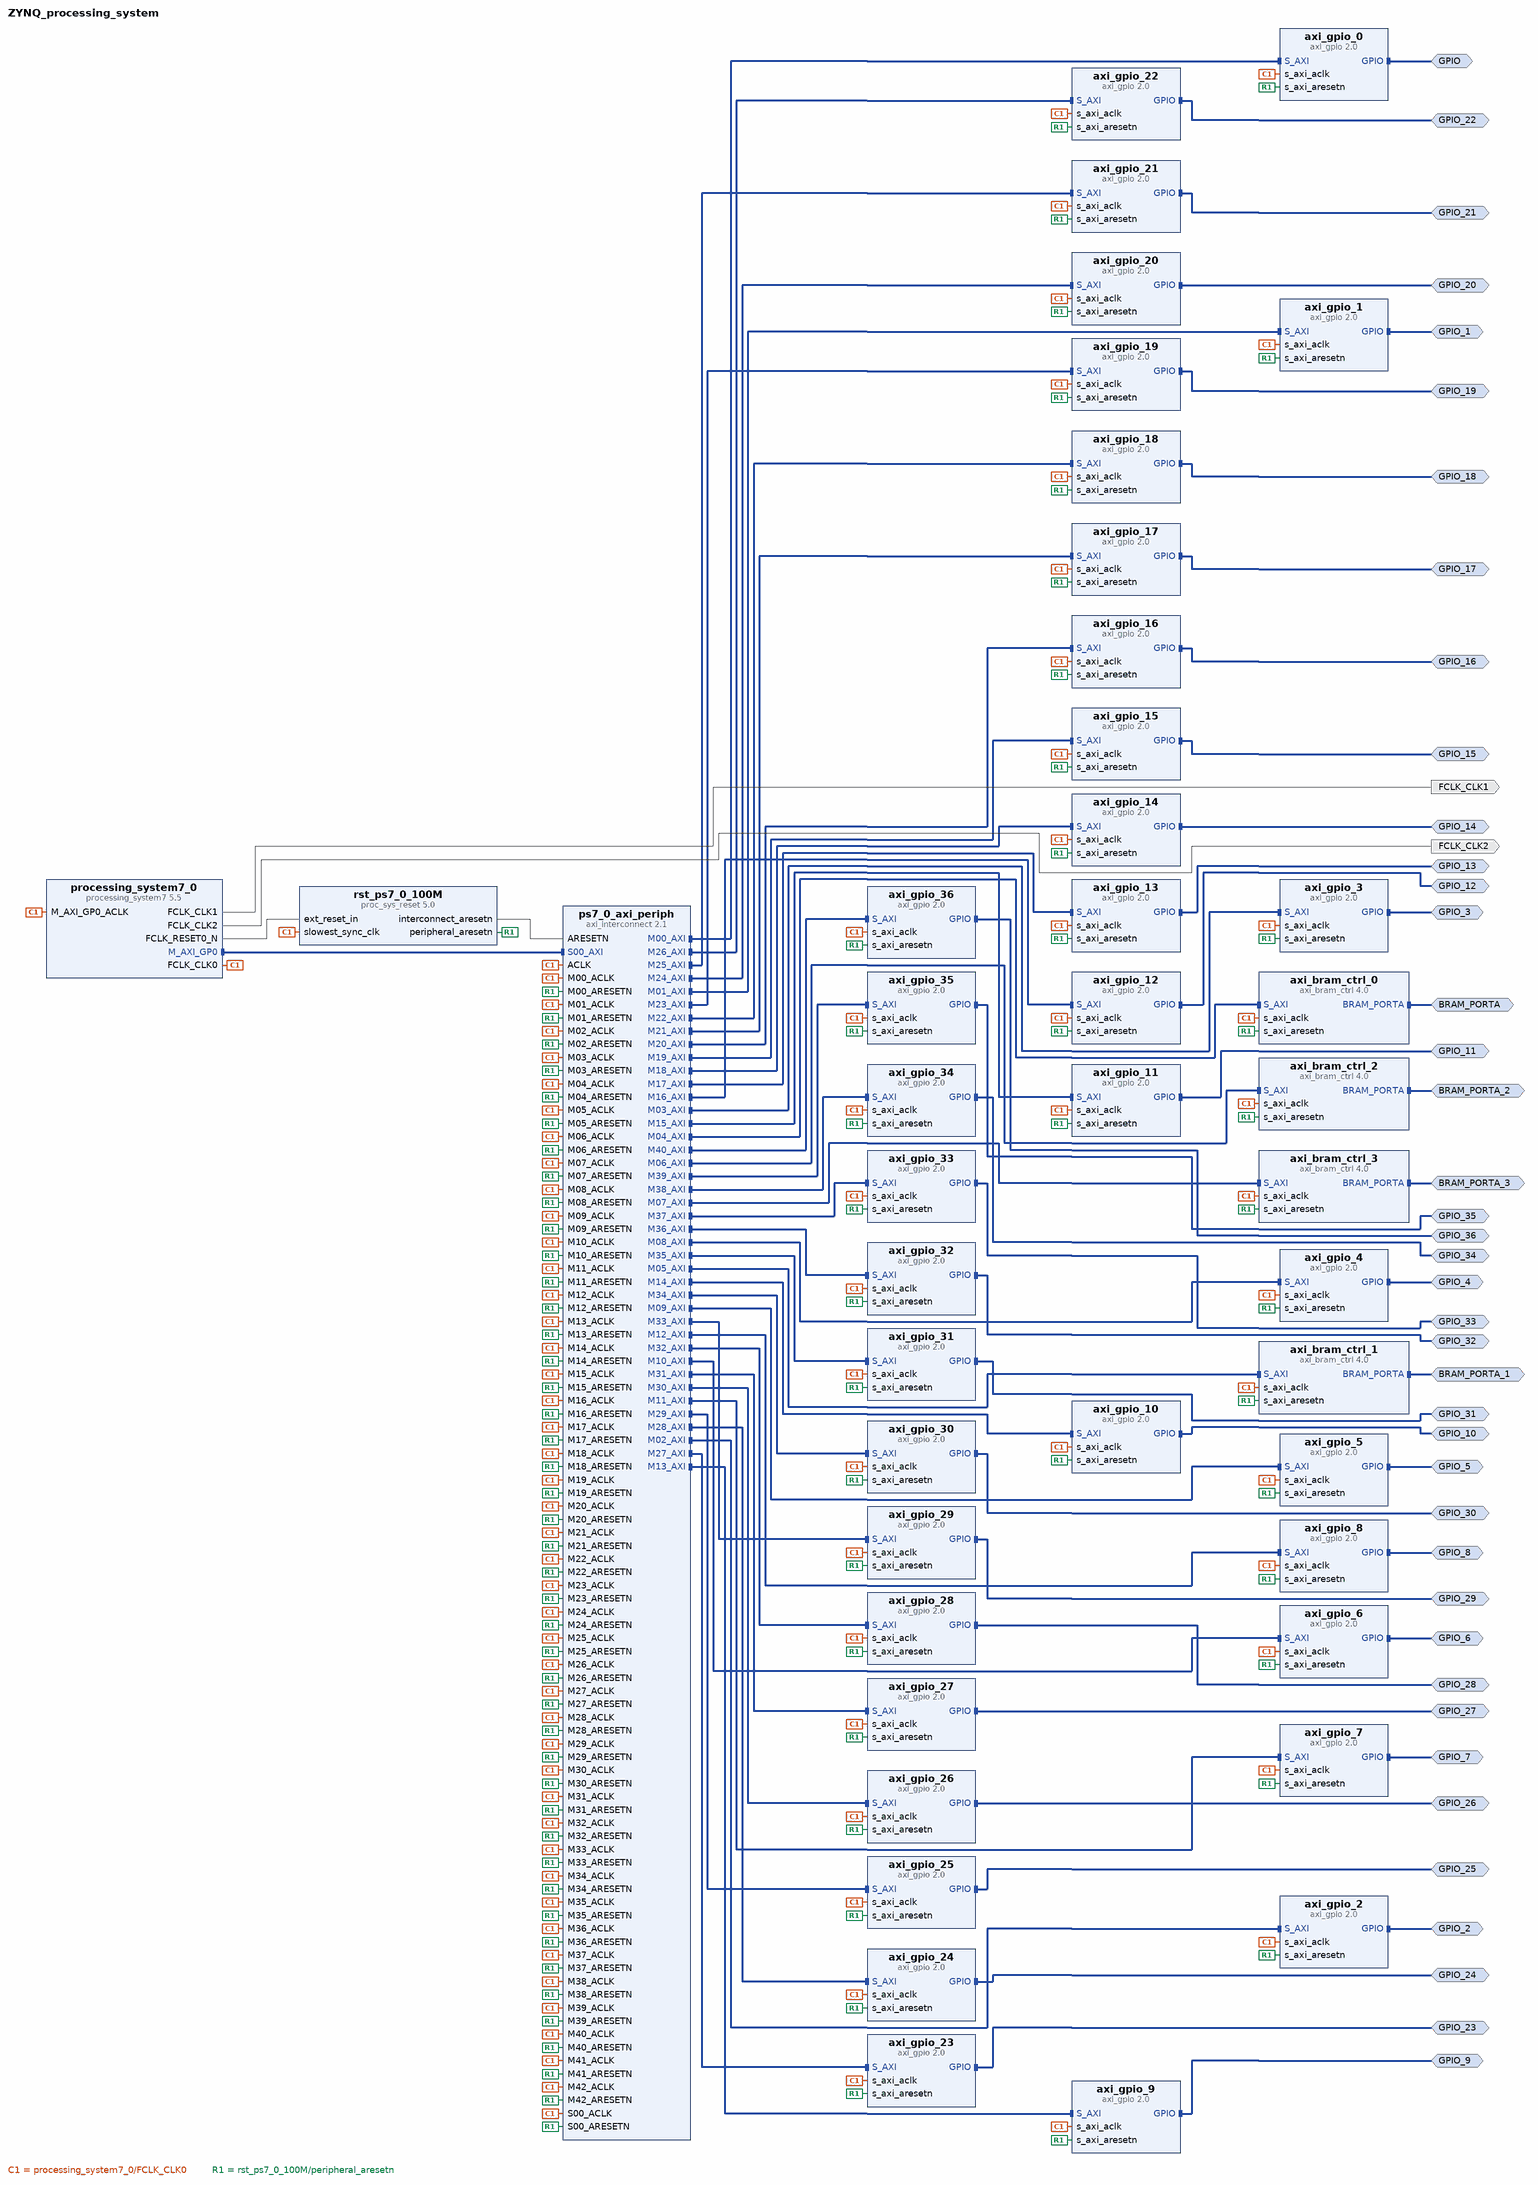
[diagram p0: block diagram of the top level]
# Vivado block design ZYNQ_processing_system, xc7z020clg484-1, Vivado 2017.1
create_bd_design ZYNQ_processing_system

create_bd_intf_port -mode Master -vlnv xilinx.com:interface:gpio_rtl:1.0 GPIO
create_bd_intf_port -mode Master -vlnv xilinx.com:interface:gpio_rtl:1.0 GPIO_1
create_bd_intf_port -mode Master -vlnv xilinx.com:interface:gpio_rtl:1.0 GPIO_3
create_bd_intf_port -mode Master -vlnv xilinx.com:interface:bram_rtl:1.0 BRAM_PORTA
set_property -dict {CONFIG.MASTER_TYPE BRAM_CTRL} [get_bd_intf_ports BRAM_PORTA]
create_bd_intf_port -mode Master -vlnv xilinx.com:interface:bram_rtl:1.0 BRAM_PORTA_1
set_property -dict {CONFIG.MASTER_TYPE BRAM_CTRL} [get_bd_intf_ports BRAM_PORTA_1]
create_bd_intf_port -mode Master -vlnv xilinx.com:interface:bram_rtl:1.0 BRAM_PORTA_2
set_property -dict {CONFIG.MASTER_TYPE BRAM_CTRL} [get_bd_intf_ports BRAM_PORTA_2]
create_bd_intf_port -mode Master -vlnv xilinx.com:interface:bram_rtl:1.0 BRAM_PORTA_3
set_property -dict {CONFIG.MASTER_TYPE BRAM_CTRL} [get_bd_intf_ports BRAM_PORTA_3]
create_bd_intf_port -mode Master -vlnv xilinx.com:interface:gpio_rtl:1.0 GPIO_4
create_bd_intf_port -mode Master -vlnv xilinx.com:interface:gpio_rtl:1.0 GPIO_5
create_bd_intf_port -mode Master -vlnv xilinx.com:interface:gpio_rtl:1.0 GPIO_6
create_bd_intf_port -mode Master -vlnv xilinx.com:interface:gpio_rtl:1.0 GPIO_7
create_bd_intf_port -mode Master -vlnv xilinx.com:interface:gpio_rtl:1.0 GPIO_8
create_bd_intf_port -mode Master -vlnv xilinx.com:interface:gpio_rtl:1.0 GPIO_9
create_bd_intf_port -mode Master -vlnv xilinx.com:interface:gpio_rtl:1.0 GPIO_10
create_bd_intf_port -mode Master -vlnv xilinx.com:interface:gpio_rtl:1.0 GPIO_11
create_bd_intf_port -mode Master -vlnv xilinx.com:interface:gpio_rtl:1.0 GPIO_12
create_bd_intf_port -mode Master -vlnv xilinx.com:interface:gpio_rtl:1.0 GPIO_13
create_bd_intf_port -mode Master -vlnv xilinx.com:interface:gpio_rtl:1.0 GPIO_14
create_bd_intf_port -mode Master -vlnv xilinx.com:interface:gpio_rtl:1.0 GPIO_15
create_bd_intf_port -mode Master -vlnv xilinx.com:interface:gpio_rtl:1.0 GPIO_16
create_bd_intf_port -mode Master -vlnv xilinx.com:interface:gpio_rtl:1.0 GPIO_17
create_bd_intf_port -mode Master -vlnv xilinx.com:interface:gpio_rtl:1.0 GPIO_18
create_bd_intf_port -mode Master -vlnv xilinx.com:interface:gpio_rtl:1.0 GPIO_19
create_bd_intf_port -mode Master -vlnv xilinx.com:interface:gpio_rtl:1.0 GPIO_20
create_bd_intf_port -mode Master -vlnv xilinx.com:interface:gpio_rtl:1.0 GPIO_21
create_bd_intf_port -mode Master -vlnv xilinx.com:interface:gpio_rtl:1.0 GPIO_22
create_bd_intf_port -mode Master -vlnv xilinx.com:interface:gpio_rtl:1.0 GPIO_23
create_bd_intf_port -mode Master -vlnv xilinx.com:interface:gpio_rtl:1.0 GPIO_24
create_bd_intf_port -mode Master -vlnv xilinx.com:interface:gpio_rtl:1.0 GPIO_25
create_bd_intf_port -mode Master -vlnv xilinx.com:interface:gpio_rtl:1.0 GPIO_26
create_bd_intf_port -mode Master -vlnv xilinx.com:interface:gpio_rtl:1.0 GPIO_27
create_bd_intf_port -mode Master -vlnv xilinx.com:interface:gpio_rtl:1.0 GPIO_28
create_bd_intf_port -mode Master -vlnv xilinx.com:interface:gpio_rtl:1.0 GPIO_29
create_bd_intf_port -mode Master -vlnv xilinx.com:interface:gpio_rtl:1.0 GPIO_30
create_bd_intf_port -mode Master -vlnv xilinx.com:interface:gpio_rtl:1.0 GPIO_31
create_bd_intf_port -mode Master -vlnv xilinx.com:interface:gpio_rtl:1.0 GPIO_32
create_bd_intf_port -mode Master -vlnv xilinx.com:interface:gpio_rtl:1.0 GPIO_33
create_bd_intf_port -mode Master -vlnv xilinx.com:interface:gpio_rtl:1.0 GPIO_34
create_bd_intf_port -mode Master -vlnv xilinx.com:interface:gpio_rtl:1.0 GPIO_35
create_bd_intf_port -mode Master -vlnv xilinx.com:interface:gpio_rtl:1.0 GPIO_36
create_bd_intf_port -mode Master -vlnv xilinx.com:interface:gpio_rtl:1.0 GPIO_2
create_bd_port -dir O -type clk FCLK_CLK1
set_property -dict {CONFIG.FREQ_HZ 50000000} [get_bd_ports FCLK_CLK1]
create_bd_port -dir O -type clk FCLK_CLK2
set_property -dict {CONFIG.FREQ_HZ 25000000} [get_bd_ports FCLK_CLK2]

create_bd_cell -type ip -vlnv xilinx.com:ip:processing_system7:5.5 processing_system7_0
set_property -dict [list \
  CONFIG.PCW_FPGA0_PERIPHERAL_FREQMHZ 50 \
  CONFIG.PCW_FPGA1_PERIPHERAL_FREQMHZ 50 \
  CONFIG.PCW_FPGA2_PERIPHERAL_FREQMHZ 25 \
  CONFIG.PCW_EN_CLK1_PORT 1 \
  CONFIG.PCW_EN_CLK2_PORT 1 \
  CONFIG.preset ZedBoard \
] [get_bd_cells processing_system7_0]
create_bd_cell -type ip -vlnv xilinx.com:ip:axi_gpio:2.0 axi_gpio_0
set_property -dict [list \
  CONFIG.C_GPIO_WIDTH 1 \
  CONFIG.C_IS_DUAL 0 \
  CONFIG.C_ALL_INPUTS 0 \
  CONFIG.USE_BOARD_FLOW true \
  CONFIG.GPIO_BOARD_INTERFACE Custom \
  CONFIG.C_ALL_OUTPUTS 1 \
] [get_bd_cells axi_gpio_0]
create_bd_cell -type ip -vlnv xilinx.com:ip:axi_interconnect:2.1 ps7_0_axi_periph
set_property -dict {CONFIG.NUM_MI 43} [get_bd_cells ps7_0_axi_periph]
create_bd_cell -type ip -vlnv xilinx.com:ip:proc_sys_reset:5.0 rst_ps7_0_100M
create_bd_cell -type ip -vlnv xilinx.com:ip:axi_gpio:2.0 axi_gpio_1
set_property -dict [list \
  CONFIG.C_GPIO_WIDTH 1 \
  CONFIG.C_ALL_INPUTS 0 \
  CONFIG.USE_BOARD_FLOW true \
  CONFIG.GPIO_BOARD_INTERFACE Custom \
  CONFIG.C_ALL_OUTPUTS 1 \
] [get_bd_cells axi_gpio_1]
create_bd_cell -type ip -vlnv xilinx.com:ip:axi_gpio:2.0 axi_gpio_3
set_property -dict {CONFIG.C_GPIO_WIDTH 1 CONFIG.USE_BOARD_FLOW true CONFIG.GPIO_BOARD_INTERFACE Custom} [get_bd_cells axi_gpio_3]
create_bd_cell -type ip -vlnv xilinx.com:ip:axi_bram_ctrl:4.0 axi_bram_ctrl_0
set_property -dict {CONFIG.PROTOCOL AXI4LITE CONFIG.SINGLE_PORT_BRAM 1} [get_bd_cells axi_bram_ctrl_0]
create_bd_cell -type ip -vlnv xilinx.com:ip:axi_bram_ctrl:4.0 axi_bram_ctrl_1
set_property -dict {CONFIG.PROTOCOL AXI4LITE CONFIG.SINGLE_PORT_BRAM 1} [get_bd_cells axi_bram_ctrl_1]
create_bd_cell -type ip -vlnv xilinx.com:ip:axi_bram_ctrl:4.0 axi_bram_ctrl_2
set_property -dict {CONFIG.PROTOCOL AXI4LITE CONFIG.SINGLE_PORT_BRAM 1} [get_bd_cells axi_bram_ctrl_2]
create_bd_cell -type ip -vlnv xilinx.com:ip:axi_bram_ctrl:4.0 axi_bram_ctrl_3
set_property -dict {CONFIG.PROTOCOL AXI4LITE CONFIG.SINGLE_PORT_BRAM 1} [get_bd_cells axi_bram_ctrl_3]
create_bd_cell -type ip -vlnv xilinx.com:ip:axi_gpio:2.0 axi_gpio_4
set_property -dict [list \
  CONFIG.USE_BOARD_FLOW true \
  CONFIG.GPIO_BOARD_INTERFACE Custom \
  CONFIG.C_ALL_OUTPUTS 1 \
] [get_bd_cells axi_gpio_4]
create_bd_cell -type ip -vlnv xilinx.com:ip:axi_gpio:2.0 axi_gpio_5
set_property -dict [list \
  CONFIG.USE_BOARD_FLOW true \
  CONFIG.GPIO_BOARD_INTERFACE Custom \
  CONFIG.C_ALL_OUTPUTS 1 \
] [get_bd_cells axi_gpio_5]
create_bd_cell -type ip -vlnv xilinx.com:ip:axi_gpio:2.0 axi_gpio_6
set_property -dict [list \
  CONFIG.USE_BOARD_FLOW true \
  CONFIG.GPIO_BOARD_INTERFACE Custom \
  CONFIG.C_ALL_OUTPUTS 1 \
] [get_bd_cells axi_gpio_6]
create_bd_cell -type ip -vlnv xilinx.com:ip:axi_gpio:2.0 axi_gpio_7
set_property -dict [list \
  CONFIG.USE_BOARD_FLOW true \
  CONFIG.GPIO_BOARD_INTERFACE Custom \
  CONFIG.C_ALL_OUTPUTS 1 \
] [get_bd_cells axi_gpio_7]
create_bd_cell -type ip -vlnv xilinx.com:ip:axi_gpio:2.0 axi_gpio_8
set_property -dict [list \
  CONFIG.USE_BOARD_FLOW true \
  CONFIG.GPIO_BOARD_INTERFACE Custom \
  CONFIG.C_ALL_OUTPUTS 1 \
] [get_bd_cells axi_gpio_8]
create_bd_cell -type ip -vlnv xilinx.com:ip:axi_gpio:2.0 axi_gpio_9
set_property -dict [list \
  CONFIG.USE_BOARD_FLOW true \
  CONFIG.GPIO_BOARD_INTERFACE Custom \
  CONFIG.C_ALL_OUTPUTS 1 \
] [get_bd_cells axi_gpio_9]
create_bd_cell -type ip -vlnv xilinx.com:ip:axi_gpio:2.0 axi_gpio_10
set_property -dict [list \
  CONFIG.USE_BOARD_FLOW true \
  CONFIG.GPIO_BOARD_INTERFACE Custom \
  CONFIG.C_ALL_OUTPUTS 1 \
] [get_bd_cells axi_gpio_10]
create_bd_cell -type ip -vlnv xilinx.com:ip:axi_gpio:2.0 axi_gpio_11
set_property -dict [list \
  CONFIG.USE_BOARD_FLOW true \
  CONFIG.GPIO_BOARD_INTERFACE Custom \
  CONFIG.C_ALL_OUTPUTS 1 \
] [get_bd_cells axi_gpio_11]
create_bd_cell -type ip -vlnv xilinx.com:ip:axi_gpio:2.0 axi_gpio_12
set_property -dict [list \
  CONFIG.USE_BOARD_FLOW true \
  CONFIG.GPIO_BOARD_INTERFACE Custom \
  CONFIG.C_ALL_OUTPUTS 1 \
] [get_bd_cells axi_gpio_12]
create_bd_cell -type ip -vlnv xilinx.com:ip:axi_gpio:2.0 axi_gpio_13
set_property -dict [list \
  CONFIG.USE_BOARD_FLOW true \
  CONFIG.GPIO_BOARD_INTERFACE Custom \
  CONFIG.C_ALL_OUTPUTS 1 \
] [get_bd_cells axi_gpio_13]
create_bd_cell -type ip -vlnv xilinx.com:ip:axi_gpio:2.0 axi_gpio_14
set_property -dict [list \
  CONFIG.USE_BOARD_FLOW true \
  CONFIG.GPIO_BOARD_INTERFACE Custom \
  CONFIG.C_ALL_OUTPUTS 1 \
] [get_bd_cells axi_gpio_14]
create_bd_cell -type ip -vlnv xilinx.com:ip:axi_gpio:2.0 axi_gpio_15
set_property -dict [list \
  CONFIG.USE_BOARD_FLOW true \
  CONFIG.GPIO_BOARD_INTERFACE Custom \
  CONFIG.C_ALL_OUTPUTS 1 \
] [get_bd_cells axi_gpio_15]
create_bd_cell -type ip -vlnv xilinx.com:ip:axi_gpio:2.0 axi_gpio_16
set_property -dict [list \
  CONFIG.C_ALL_INPUTS 1 \
  CONFIG.USE_BOARD_FLOW true \
  CONFIG.GPIO_BOARD_INTERFACE Custom \
] [get_bd_cells axi_gpio_16]
create_bd_cell -type ip -vlnv xilinx.com:ip:axi_gpio:2.0 axi_gpio_17
set_property -dict [list \
  CONFIG.C_ALL_INPUTS 1 \
  CONFIG.USE_BOARD_FLOW true \
  CONFIG.GPIO_BOARD_INTERFACE Custom \
] [get_bd_cells axi_gpio_17]
create_bd_cell -type ip -vlnv xilinx.com:ip:axi_gpio:2.0 axi_gpio_18
set_property -dict [list \
  CONFIG.C_ALL_INPUTS 1 \
  CONFIG.USE_BOARD_FLOW true \
  CONFIG.GPIO_BOARD_INTERFACE Custom \
] [get_bd_cells axi_gpio_18]
create_bd_cell -type ip -vlnv xilinx.com:ip:axi_gpio:2.0 axi_gpio_19
set_property -dict [list \
  CONFIG.C_ALL_INPUTS 1 \
  CONFIG.USE_BOARD_FLOW true \
  CONFIG.GPIO_BOARD_INTERFACE Custom \
] [get_bd_cells axi_gpio_19]
create_bd_cell -type ip -vlnv xilinx.com:ip:axi_gpio:2.0 axi_gpio_20
set_property -dict [list \
  CONFIG.C_ALL_INPUTS 1 \
  CONFIG.USE_BOARD_FLOW true \
  CONFIG.GPIO_BOARD_INTERFACE Custom \
] [get_bd_cells axi_gpio_20]
create_bd_cell -type ip -vlnv xilinx.com:ip:axi_gpio:2.0 axi_gpio_21
set_property -dict [list \
  CONFIG.C_ALL_INPUTS 1 \
  CONFIG.USE_BOARD_FLOW true \
  CONFIG.GPIO_BOARD_INTERFACE Custom \
] [get_bd_cells axi_gpio_21]
create_bd_cell -type ip -vlnv xilinx.com:ip:axi_gpio:2.0 axi_gpio_22
set_property -dict [list \
  CONFIG.C_ALL_INPUTS 1 \
  CONFIG.USE_BOARD_FLOW true \
  CONFIG.GPIO_BOARD_INTERFACE Custom \
] [get_bd_cells axi_gpio_22]
create_bd_cell -type ip -vlnv xilinx.com:ip:axi_gpio:2.0 axi_gpio_23
set_property -dict [list \
  CONFIG.C_ALL_INPUTS 1 \
  CONFIG.USE_BOARD_FLOW true \
  CONFIG.GPIO_BOARD_INTERFACE Custom \
] [get_bd_cells axi_gpio_23]
create_bd_cell -type ip -vlnv xilinx.com:ip:axi_gpio:2.0 axi_gpio_24
set_property -dict [list \
  CONFIG.C_ALL_INPUTS 1 \
  CONFIG.USE_BOARD_FLOW true \
  CONFIG.GPIO_BOARD_INTERFACE Custom \
] [get_bd_cells axi_gpio_24]
create_bd_cell -type ip -vlnv xilinx.com:ip:axi_gpio:2.0 axi_gpio_25
set_property -dict [list \
  CONFIG.C_ALL_INPUTS 1 \
  CONFIG.USE_BOARD_FLOW true \
  CONFIG.GPIO_BOARD_INTERFACE Custom \
] [get_bd_cells axi_gpio_25]
create_bd_cell -type ip -vlnv xilinx.com:ip:axi_gpio:2.0 axi_gpio_26
set_property -dict [list \
  CONFIG.C_ALL_INPUTS 1 \
  CONFIG.USE_BOARD_FLOW true \
  CONFIG.GPIO_BOARD_INTERFACE Custom \
] [get_bd_cells axi_gpio_26]
create_bd_cell -type ip -vlnv xilinx.com:ip:axi_gpio:2.0 axi_gpio_27
set_property -dict [list \
  CONFIG.C_ALL_INPUTS 1 \
  CONFIG.USE_BOARD_FLOW true \
  CONFIG.GPIO_BOARD_INTERFACE Custom \
] [get_bd_cells axi_gpio_27]
create_bd_cell -type ip -vlnv xilinx.com:ip:axi_gpio:2.0 axi_gpio_28
set_property -dict [list \
  CONFIG.C_GPIO_WIDTH 32 \
  CONFIG.USE_BOARD_FLOW true \
  CONFIG.GPIO_BOARD_INTERFACE Custom \
  CONFIG.C_ALL_OUTPUTS 1 \
] [get_bd_cells axi_gpio_28]
create_bd_cell -type ip -vlnv xilinx.com:ip:axi_gpio:2.0 axi_gpio_29
set_property -dict [list \
  CONFIG.C_GPIO_WIDTH 1 \
  CONFIG.USE_BOARD_FLOW true \
  CONFIG.GPIO_BOARD_INTERFACE Custom \
  CONFIG.C_ALL_OUTPUTS 1 \
] [get_bd_cells axi_gpio_29]
create_bd_cell -type ip -vlnv xilinx.com:ip:axi_gpio:2.0 axi_gpio_30
set_property -dict [list \
  CONFIG.C_GPIO_WIDTH 1 \
  CONFIG.USE_BOARD_FLOW true \
  CONFIG.GPIO_BOARD_INTERFACE Custom \
  CONFIG.C_ALL_OUTPUTS 1 \
] [get_bd_cells axi_gpio_30]
create_bd_cell -type ip -vlnv xilinx.com:ip:axi_gpio:2.0 axi_gpio_31
set_property -dict [list \
  CONFIG.C_GPIO_WIDTH 2 \
  CONFIG.C_ALL_INPUTS 1 \
  CONFIG.USE_BOARD_FLOW true \
  CONFIG.GPIO_BOARD_INTERFACE Custom \
] [get_bd_cells axi_gpio_31]
create_bd_cell -type ip -vlnv xilinx.com:ip:axi_gpio:2.0 axi_gpio_32
set_property -dict [list \
  CONFIG.C_GPIO_WIDTH 12 \
  CONFIG.C_ALL_INPUTS 1 \
  CONFIG.USE_BOARD_FLOW true \
  CONFIG.GPIO_BOARD_INTERFACE Custom \
] [get_bd_cells axi_gpio_32]
create_bd_cell -type ip -vlnv xilinx.com:ip:axi_gpio:2.0 axi_gpio_33
set_property -dict [list \
  CONFIG.C_GPIO_WIDTH 1 \
  CONFIG.C_ALL_INPUTS 1 \
  CONFIG.USE_BOARD_FLOW true \
  CONFIG.GPIO_BOARD_INTERFACE Custom \
] [get_bd_cells axi_gpio_33]
create_bd_cell -type ip -vlnv xilinx.com:ip:axi_gpio:2.0 axi_gpio_34
set_property -dict [list \
  CONFIG.C_GPIO_WIDTH 1 \
  CONFIG.C_ALL_INPUTS 1 \
  CONFIG.USE_BOARD_FLOW true \
  CONFIG.GPIO_BOARD_INTERFACE Custom \
] [get_bd_cells axi_gpio_34]
create_bd_cell -type ip -vlnv xilinx.com:ip:axi_gpio:2.0 axi_gpio_35
set_property -dict [list \
  CONFIG.C_GPIO_WIDTH 1 \
  CONFIG.USE_BOARD_FLOW true \
  CONFIG.GPIO_BOARD_INTERFACE Custom \
  CONFIG.C_ALL_OUTPUTS 1 \
] [get_bd_cells axi_gpio_35]
create_bd_cell -type ip -vlnv xilinx.com:ip:axi_gpio:2.0 axi_gpio_36
set_property -dict [list \
  CONFIG.C_GPIO_WIDTH 1 \
  CONFIG.C_ALL_INPUTS 1 \
  CONFIG.USE_BOARD_FLOW true \
  CONFIG.GPIO_BOARD_INTERFACE Custom \
] [get_bd_cells axi_gpio_36]
create_bd_cell -type ip -vlnv xilinx.com:ip:axi_gpio:2.0 axi_gpio_2
set_property -dict [list \
  CONFIG.C_GPIO_WIDTH 1 \
  CONFIG.USE_BOARD_FLOW true \
  CONFIG.GPIO_BOARD_INTERFACE Custom \
  CONFIG.C_ALL_OUTPUTS 1 \
] [get_bd_cells axi_gpio_2]

# ---- connections ----

connect_bd_intf_net [get_bd_intf_pins processing_system7_0/M_AXI_GP0] [get_bd_intf_pins ps7_0_axi_periph/S00_AXI]
connect_bd_intf_net [get_bd_intf_pins ps7_0_axi_periph/M00_AXI] [get_bd_intf_pins axi_gpio_0/S_AXI]
connect_bd_intf_net [get_bd_intf_pins ps7_0_axi_periph/M01_AXI] [get_bd_intf_pins axi_gpio_1/S_AXI]
connect_bd_intf_net [get_bd_intf_pins ps7_0_axi_periph/M03_AXI] [get_bd_intf_pins axi_gpio_3/S_AXI]
connect_bd_intf_net [get_bd_intf_pins ps7_0_axi_periph/M04_AXI] [get_bd_intf_pins axi_bram_ctrl_0/S_AXI]
connect_bd_intf_net [get_bd_intf_pins ps7_0_axi_periph/M05_AXI] [get_bd_intf_pins axi_bram_ctrl_1/S_AXI]
connect_bd_intf_net [get_bd_intf_pins ps7_0_axi_periph/M06_AXI] [get_bd_intf_pins axi_bram_ctrl_2/S_AXI]
connect_bd_intf_net [get_bd_intf_pins ps7_0_axi_periph/M07_AXI] [get_bd_intf_pins axi_bram_ctrl_3/S_AXI]
connect_bd_intf_net [get_bd_intf_pins ps7_0_axi_periph/M08_AXI] [get_bd_intf_pins axi_gpio_4/S_AXI]
connect_bd_intf_net [get_bd_intf_pins ps7_0_axi_periph/M09_AXI] [get_bd_intf_pins axi_gpio_5/S_AXI]
connect_bd_intf_net [get_bd_intf_pins ps7_0_axi_periph/M10_AXI] [get_bd_intf_pins axi_gpio_6/S_AXI]
connect_bd_intf_net [get_bd_intf_pins ps7_0_axi_periph/M11_AXI] [get_bd_intf_pins axi_gpio_7/S_AXI]
connect_bd_intf_net [get_bd_intf_pins ps7_0_axi_periph/M12_AXI] [get_bd_intf_pins axi_gpio_8/S_AXI]
connect_bd_intf_net [get_bd_intf_pins ps7_0_axi_periph/M13_AXI] [get_bd_intf_pins axi_gpio_9/S_AXI]
connect_bd_intf_net [get_bd_intf_pins ps7_0_axi_periph/M14_AXI] [get_bd_intf_pins axi_gpio_10/S_AXI]
connect_bd_intf_net [get_bd_intf_pins ps7_0_axi_periph/M15_AXI] [get_bd_intf_pins axi_gpio_11/S_AXI]
connect_bd_intf_net [get_bd_intf_pins ps7_0_axi_periph/M16_AXI] [get_bd_intf_pins axi_gpio_12/S_AXI]
connect_bd_intf_net [get_bd_intf_pins ps7_0_axi_periph/M17_AXI] [get_bd_intf_pins axi_gpio_13/S_AXI]
connect_bd_intf_net [get_bd_intf_pins ps7_0_axi_periph/M18_AXI] [get_bd_intf_pins axi_gpio_14/S_AXI]
connect_bd_intf_net [get_bd_intf_pins ps7_0_axi_periph/M19_AXI] [get_bd_intf_pins axi_gpio_15/S_AXI]
connect_bd_intf_net [get_bd_intf_pins ps7_0_axi_periph/M20_AXI] [get_bd_intf_pins axi_gpio_16/S_AXI]
connect_bd_intf_net [get_bd_intf_pins ps7_0_axi_periph/M21_AXI] [get_bd_intf_pins axi_gpio_17/S_AXI]
connect_bd_intf_net [get_bd_intf_pins ps7_0_axi_periph/M22_AXI] [get_bd_intf_pins axi_gpio_18/S_AXI]
connect_bd_intf_net [get_bd_intf_pins ps7_0_axi_periph/M23_AXI] [get_bd_intf_pins axi_gpio_19/S_AXI]
connect_bd_intf_net [get_bd_intf_pins ps7_0_axi_periph/M24_AXI] [get_bd_intf_pins axi_gpio_20/S_AXI]
connect_bd_intf_net [get_bd_intf_pins ps7_0_axi_periph/M25_AXI] [get_bd_intf_pins axi_gpio_21/S_AXI]
connect_bd_intf_net [get_bd_intf_pins ps7_0_axi_periph/M26_AXI] [get_bd_intf_pins axi_gpio_22/S_AXI]
connect_bd_intf_net [get_bd_intf_pins ps7_0_axi_periph/M27_AXI] [get_bd_intf_pins axi_gpio_23/S_AXI]
connect_bd_intf_net [get_bd_intf_pins ps7_0_axi_periph/M28_AXI] [get_bd_intf_pins axi_gpio_24/S_AXI]
connect_bd_intf_net [get_bd_intf_pins ps7_0_axi_periph/M29_AXI] [get_bd_intf_pins axi_gpio_25/S_AXI]
connect_bd_intf_net [get_bd_intf_pins ps7_0_axi_periph/M30_AXI] [get_bd_intf_pins axi_gpio_26/S_AXI]
connect_bd_intf_net [get_bd_intf_pins ps7_0_axi_periph/M31_AXI] [get_bd_intf_pins axi_gpio_27/S_AXI]
connect_bd_intf_net [get_bd_intf_pins ps7_0_axi_periph/M32_AXI] [get_bd_intf_pins axi_gpio_28/S_AXI]
connect_bd_intf_net [get_bd_intf_pins ps7_0_axi_periph/M33_AXI] [get_bd_intf_pins axi_gpio_29/S_AXI]
connect_bd_intf_net [get_bd_intf_pins ps7_0_axi_periph/M34_AXI] [get_bd_intf_pins axi_gpio_30/S_AXI]
connect_bd_intf_net [get_bd_intf_pins ps7_0_axi_periph/M35_AXI] [get_bd_intf_pins axi_gpio_31/S_AXI]
connect_bd_intf_net [get_bd_intf_pins ps7_0_axi_periph/M36_AXI] [get_bd_intf_pins axi_gpio_32/S_AXI]
connect_bd_intf_net [get_bd_intf_pins ps7_0_axi_periph/M37_AXI] [get_bd_intf_pins axi_gpio_33/S_AXI]
connect_bd_intf_net [get_bd_intf_pins ps7_0_axi_periph/M38_AXI] [get_bd_intf_pins axi_gpio_34/S_AXI]
connect_bd_intf_net [get_bd_intf_pins ps7_0_axi_periph/M39_AXI] [get_bd_intf_pins axi_gpio_35/S_AXI]
connect_bd_intf_net [get_bd_intf_pins ps7_0_axi_periph/M40_AXI] [get_bd_intf_pins axi_gpio_36/S_AXI]
connect_bd_intf_net [get_bd_intf_pins ps7_0_axi_periph/M02_AXI] [get_bd_intf_pins axi_gpio_2/S_AXI]
connect_bd_intf_net [get_bd_intf_ports GPIO] [get_bd_intf_pins axi_gpio_0/GPIO]
connect_bd_intf_net [get_bd_intf_ports GPIO_1] [get_bd_intf_pins axi_gpio_1/GPIO]
connect_bd_intf_net [get_bd_intf_ports GPIO_3] [get_bd_intf_pins axi_gpio_3/GPIO]
connect_bd_intf_net [get_bd_intf_ports BRAM_PORTA] [get_bd_intf_pins axi_bram_ctrl_0/BRAM_PORTA]
connect_bd_intf_net [get_bd_intf_ports BRAM_PORTA_1] [get_bd_intf_pins axi_bram_ctrl_1/BRAM_PORTA]
connect_bd_intf_net [get_bd_intf_ports BRAM_PORTA_2] [get_bd_intf_pins axi_bram_ctrl_2/BRAM_PORTA]
connect_bd_intf_net [get_bd_intf_ports BRAM_PORTA_3] [get_bd_intf_pins axi_bram_ctrl_3/BRAM_PORTA]
connect_bd_intf_net [get_bd_intf_ports GPIO_4] [get_bd_intf_pins axi_gpio_4/GPIO]
connect_bd_intf_net [get_bd_intf_ports GPIO_5] [get_bd_intf_pins axi_gpio_5/GPIO]
connect_bd_intf_net [get_bd_intf_ports GPIO_6] [get_bd_intf_pins axi_gpio_6/GPIO]
connect_bd_intf_net [get_bd_intf_ports GPIO_7] [get_bd_intf_pins axi_gpio_7/GPIO]
connect_bd_intf_net [get_bd_intf_ports GPIO_8] [get_bd_intf_pins axi_gpio_8/GPIO]
connect_bd_intf_net [get_bd_intf_ports GPIO_9] [get_bd_intf_pins axi_gpio_9/GPIO]
connect_bd_intf_net [get_bd_intf_ports GPIO_10] [get_bd_intf_pins axi_gpio_10/GPIO]
connect_bd_intf_net [get_bd_intf_ports GPIO_11] [get_bd_intf_pins axi_gpio_11/GPIO]
connect_bd_intf_net [get_bd_intf_ports GPIO_12] [get_bd_intf_pins axi_gpio_12/GPIO]
connect_bd_intf_net [get_bd_intf_ports GPIO_13] [get_bd_intf_pins axi_gpio_13/GPIO]
connect_bd_intf_net [get_bd_intf_ports GPIO_14] [get_bd_intf_pins axi_gpio_14/GPIO]
connect_bd_intf_net [get_bd_intf_ports GPIO_15] [get_bd_intf_pins axi_gpio_15/GPIO]
connect_bd_intf_net [get_bd_intf_ports GPIO_16] [get_bd_intf_pins axi_gpio_16/GPIO]
connect_bd_intf_net [get_bd_intf_ports GPIO_17] [get_bd_intf_pins axi_gpio_17/GPIO]
connect_bd_intf_net [get_bd_intf_ports GPIO_18] [get_bd_intf_pins axi_gpio_18/GPIO]
connect_bd_intf_net [get_bd_intf_ports GPIO_19] [get_bd_intf_pins axi_gpio_19/GPIO]
connect_bd_intf_net [get_bd_intf_ports GPIO_20] [get_bd_intf_pins axi_gpio_20/GPIO]
connect_bd_intf_net [get_bd_intf_ports GPIO_21] [get_bd_intf_pins axi_gpio_21/GPIO]
connect_bd_intf_net [get_bd_intf_ports GPIO_22] [get_bd_intf_pins axi_gpio_22/GPIO]
connect_bd_intf_net [get_bd_intf_ports GPIO_23] [get_bd_intf_pins axi_gpio_23/GPIO]
connect_bd_intf_net [get_bd_intf_ports GPIO_24] [get_bd_intf_pins axi_gpio_24/GPIO]
connect_bd_intf_net [get_bd_intf_ports GPIO_25] [get_bd_intf_pins axi_gpio_25/GPIO]
connect_bd_intf_net [get_bd_intf_ports GPIO_26] [get_bd_intf_pins axi_gpio_26/GPIO]
connect_bd_intf_net [get_bd_intf_ports GPIO_27] [get_bd_intf_pins axi_gpio_27/GPIO]
connect_bd_intf_net [get_bd_intf_ports GPIO_28] [get_bd_intf_pins axi_gpio_28/GPIO]
connect_bd_intf_net [get_bd_intf_ports GPIO_29] [get_bd_intf_pins axi_gpio_29/GPIO]
connect_bd_intf_net [get_bd_intf_ports GPIO_30] [get_bd_intf_pins axi_gpio_30/GPIO]
connect_bd_intf_net [get_bd_intf_ports GPIO_31] [get_bd_intf_pins axi_gpio_31/GPIO]
connect_bd_intf_net [get_bd_intf_ports GPIO_32] [get_bd_intf_pins axi_gpio_32/GPIO]
connect_bd_intf_net [get_bd_intf_ports GPIO_33] [get_bd_intf_pins axi_gpio_33/GPIO]
connect_bd_intf_net [get_bd_intf_ports GPIO_34] [get_bd_intf_pins axi_gpio_34/GPIO]
connect_bd_intf_net [get_bd_intf_ports GPIO_35] [get_bd_intf_pins axi_gpio_35/GPIO]
connect_bd_intf_net [get_bd_intf_ports GPIO_36] [get_bd_intf_pins axi_gpio_36/GPIO]
connect_bd_intf_net [get_bd_intf_ports GPIO_2] [get_bd_intf_pins axi_gpio_2/GPIO]
connect_bd_net [get_bd_pins processing_system7_0/FCLK_CLK0] \
  [get_bd_pins processing_system7_0/M_AXI_GP0_ACLK] [get_bd_pins rst_ps7_0_100M/slowest_sync_clk] \
  [get_bd_pins axi_gpio_0/s_axi_aclk] [get_bd_pins axi_gpio_1/s_axi_aclk] [get_bd_pins axi_gpio_3/s_axi_aclk] \
  [get_bd_pins axi_bram_ctrl_0/s_axi_aclk] [get_bd_pins axi_bram_ctrl_1/s_axi_aclk] [get_bd_pins axi_bram_ctrl_2/s_axi_aclk] \
  [get_bd_pins axi_bram_ctrl_3/s_axi_aclk] [get_bd_pins axi_gpio_4/s_axi_aclk] [get_bd_pins axi_gpio_5/s_axi_aclk] \
  [get_bd_pins axi_gpio_6/s_axi_aclk] [get_bd_pins axi_gpio_7/s_axi_aclk] [get_bd_pins axi_gpio_8/s_axi_aclk] \
  [get_bd_pins axi_gpio_9/s_axi_aclk] [get_bd_pins axi_gpio_10/s_axi_aclk] [get_bd_pins axi_gpio_11/s_axi_aclk] \
  [get_bd_pins axi_gpio_12/s_axi_aclk] [get_bd_pins axi_gpio_13/s_axi_aclk] [get_bd_pins axi_gpio_14/s_axi_aclk] \
  [get_bd_pins axi_gpio_15/s_axi_aclk] [get_bd_pins axi_gpio_16/s_axi_aclk] [get_bd_pins axi_gpio_17/s_axi_aclk] \
  [get_bd_pins axi_gpio_18/s_axi_aclk] [get_bd_pins axi_gpio_19/s_axi_aclk] [get_bd_pins axi_gpio_20/s_axi_aclk] \
  [get_bd_pins axi_gpio_21/s_axi_aclk] [get_bd_pins axi_gpio_22/s_axi_aclk] [get_bd_pins axi_gpio_23/s_axi_aclk] \
  [get_bd_pins axi_gpio_24/s_axi_aclk] [get_bd_pins axi_gpio_25/s_axi_aclk] [get_bd_pins axi_gpio_26/s_axi_aclk] \
  [get_bd_pins axi_gpio_27/s_axi_aclk] [get_bd_pins axi_gpio_28/s_axi_aclk] [get_bd_pins axi_gpio_29/s_axi_aclk] \
  [get_bd_pins axi_gpio_30/s_axi_aclk] [get_bd_pins axi_gpio_31/s_axi_aclk] [get_bd_pins axi_gpio_32/s_axi_aclk] \
  [get_bd_pins axi_gpio_33/s_axi_aclk] [get_bd_pins axi_gpio_34/s_axi_aclk] [get_bd_pins axi_gpio_35/s_axi_aclk] \
  [get_bd_pins axi_gpio_36/s_axi_aclk] [get_bd_pins ps7_0_axi_periph/S00_ACLK] [get_bd_pins ps7_0_axi_periph/M00_ACLK] \
  [get_bd_pins ps7_0_axi_periph/ACLK] [get_bd_pins ps7_0_axi_periph/M01_ACLK] [get_bd_pins ps7_0_axi_periph/M02_ACLK] \
  [get_bd_pins ps7_0_axi_periph/M03_ACLK] [get_bd_pins ps7_0_axi_periph/M04_ACLK] [get_bd_pins ps7_0_axi_periph/M05_ACLK] \
  [get_bd_pins ps7_0_axi_periph/M06_ACLK] [get_bd_pins ps7_0_axi_periph/M07_ACLK] [get_bd_pins ps7_0_axi_periph/M08_ACLK] \
  [get_bd_pins ps7_0_axi_periph/M09_ACLK] [get_bd_pins ps7_0_axi_periph/M10_ACLK] [get_bd_pins ps7_0_axi_periph/M11_ACLK] \
  [get_bd_pins ps7_0_axi_periph/M12_ACLK] [get_bd_pins ps7_0_axi_periph/M13_ACLK] [get_bd_pins ps7_0_axi_periph/M14_ACLK] \
  [get_bd_pins ps7_0_axi_periph/M15_ACLK] [get_bd_pins ps7_0_axi_periph/M16_ACLK] [get_bd_pins ps7_0_axi_periph/M17_ACLK] \
  [get_bd_pins ps7_0_axi_periph/M18_ACLK] [get_bd_pins ps7_0_axi_periph/M19_ACLK] [get_bd_pins ps7_0_axi_periph/M20_ACLK] \
  [get_bd_pins ps7_0_axi_periph/M21_ACLK] [get_bd_pins ps7_0_axi_periph/M22_ACLK] [get_bd_pins ps7_0_axi_periph/M23_ACLK] \
  [get_bd_pins ps7_0_axi_periph/M24_ACLK] [get_bd_pins ps7_0_axi_periph/M25_ACLK] [get_bd_pins ps7_0_axi_periph/M26_ACLK] \
  [get_bd_pins ps7_0_axi_periph/M27_ACLK] [get_bd_pins ps7_0_axi_periph/M28_ACLK] [get_bd_pins ps7_0_axi_periph/M29_ACLK] \
  [get_bd_pins ps7_0_axi_periph/M30_ACLK] [get_bd_pins ps7_0_axi_periph/M31_ACLK] [get_bd_pins ps7_0_axi_periph/M32_ACLK] \
  [get_bd_pins ps7_0_axi_periph/M33_ACLK] [get_bd_pins ps7_0_axi_periph/M34_ACLK] [get_bd_pins ps7_0_axi_periph/M35_ACLK] \
  [get_bd_pins ps7_0_axi_periph/M36_ACLK] [get_bd_pins ps7_0_axi_periph/M37_ACLK] [get_bd_pins ps7_0_axi_periph/M38_ACLK] \
  [get_bd_pins ps7_0_axi_periph/M39_ACLK] [get_bd_pins ps7_0_axi_periph/M40_ACLK] [get_bd_pins ps7_0_axi_periph/M41_ACLK] \
  [get_bd_pins ps7_0_axi_periph/M42_ACLK] [get_bd_pins axi_gpio_2/s_axi_aclk]
connect_bd_net [get_bd_pins processing_system7_0/FCLK_RESET0_N] [get_bd_pins rst_ps7_0_100M/ext_reset_in]
connect_bd_net [get_bd_pins rst_ps7_0_100M/peripheral_aresetn] \
  [get_bd_pins axi_gpio_0/s_axi_aresetn] [get_bd_pins axi_gpio_1/s_axi_aresetn] [get_bd_pins axi_gpio_3/s_axi_aresetn] \
  [get_bd_pins axi_bram_ctrl_0/s_axi_aresetn] [get_bd_pins axi_bram_ctrl_1/s_axi_aresetn] \
  [get_bd_pins axi_bram_ctrl_2/s_axi_aresetn] [get_bd_pins axi_bram_ctrl_3/s_axi_aresetn] \
  [get_bd_pins axi_gpio_4/s_axi_aresetn] [get_bd_pins axi_gpio_5/s_axi_aresetn] [get_bd_pins axi_gpio_6/s_axi_aresetn] \
  [get_bd_pins axi_gpio_7/s_axi_aresetn] [get_bd_pins axi_gpio_8/s_axi_aresetn] [get_bd_pins axi_gpio_9/s_axi_aresetn] \
  [get_bd_pins axi_gpio_10/s_axi_aresetn] [get_bd_pins axi_gpio_11/s_axi_aresetn] [get_bd_pins axi_gpio_12/s_axi_aresetn] \
  [get_bd_pins axi_gpio_13/s_axi_aresetn] [get_bd_pins axi_gpio_14/s_axi_aresetn] [get_bd_pins axi_gpio_15/s_axi_aresetn] \
  [get_bd_pins axi_gpio_16/s_axi_aresetn] [get_bd_pins axi_gpio_17/s_axi_aresetn] [get_bd_pins axi_gpio_18/s_axi_aresetn] \
  [get_bd_pins axi_gpio_19/s_axi_aresetn] [get_bd_pins axi_gpio_20/s_axi_aresetn] [get_bd_pins axi_gpio_21/s_axi_aresetn] \
  [get_bd_pins axi_gpio_22/s_axi_aresetn] [get_bd_pins axi_gpio_23/s_axi_aresetn] [get_bd_pins axi_gpio_24/s_axi_aresetn] \
  [get_bd_pins axi_gpio_25/s_axi_aresetn] [get_bd_pins axi_gpio_26/s_axi_aresetn] [get_bd_pins axi_gpio_27/s_axi_aresetn] \
  [get_bd_pins axi_gpio_28/s_axi_aresetn] [get_bd_pins axi_gpio_29/s_axi_aresetn] [get_bd_pins axi_gpio_30/s_axi_aresetn] \
  [get_bd_pins axi_gpio_31/s_axi_aresetn] [get_bd_pins axi_gpio_32/s_axi_aresetn] [get_bd_pins axi_gpio_33/s_axi_aresetn] \
  [get_bd_pins axi_gpio_34/s_axi_aresetn] [get_bd_pins axi_gpio_35/s_axi_aresetn] [get_bd_pins axi_gpio_36/s_axi_aresetn] \
  [get_bd_pins ps7_0_axi_periph/S00_ARESETN] [get_bd_pins ps7_0_axi_periph/M00_ARESETN] \
  [get_bd_pins ps7_0_axi_periph/M01_ARESETN] [get_bd_pins ps7_0_axi_periph/M02_ARESETN] \
  [get_bd_pins ps7_0_axi_periph/M03_ARESETN] [get_bd_pins ps7_0_axi_periph/M04_ARESETN] \
  [get_bd_pins ps7_0_axi_periph/M05_ARESETN] [get_bd_pins ps7_0_axi_periph/M06_ARESETN] \
  [get_bd_pins ps7_0_axi_periph/M07_ARESETN] [get_bd_pins ps7_0_axi_periph/M08_ARESETN] \
  [get_bd_pins ps7_0_axi_periph/M09_ARESETN] [get_bd_pins ps7_0_axi_periph/M10_ARESETN] \
  [get_bd_pins ps7_0_axi_periph/M11_ARESETN] [get_bd_pins ps7_0_axi_periph/M12_ARESETN] \
  [get_bd_pins ps7_0_axi_periph/M13_ARESETN] [get_bd_pins ps7_0_axi_periph/M14_ARESETN] \
  [get_bd_pins ps7_0_axi_periph/M15_ARESETN] [get_bd_pins ps7_0_axi_periph/M16_ARESETN] \
  [get_bd_pins ps7_0_axi_periph/M17_ARESETN] [get_bd_pins ps7_0_axi_periph/M18_ARESETN] \
  [get_bd_pins ps7_0_axi_periph/M19_ARESETN] [get_bd_pins ps7_0_axi_periph/M20_ARESETN] \
  [get_bd_pins ps7_0_axi_periph/M21_ARESETN] [get_bd_pins ps7_0_axi_periph/M22_ARESETN] \
  [get_bd_pins ps7_0_axi_periph/M23_ARESETN] [get_bd_pins ps7_0_axi_periph/M24_ARESETN] \
  [get_bd_pins ps7_0_axi_periph/M25_ARESETN] [get_bd_pins ps7_0_axi_periph/M26_ARESETN] \
  [get_bd_pins ps7_0_axi_periph/M27_ARESETN] [get_bd_pins ps7_0_axi_periph/M28_ARESETN] \
  [get_bd_pins ps7_0_axi_periph/M29_ARESETN] [get_bd_pins ps7_0_axi_periph/M30_ARESETN] \
  [get_bd_pins ps7_0_axi_periph/M31_ARESETN] [get_bd_pins ps7_0_axi_periph/M32_ARESETN] \
  [get_bd_pins ps7_0_axi_periph/M33_ARESETN] [get_bd_pins ps7_0_axi_periph/M34_ARESETN] \
  [get_bd_pins ps7_0_axi_periph/M35_ARESETN] [get_bd_pins ps7_0_axi_periph/M36_ARESETN] \
  [get_bd_pins ps7_0_axi_periph/M37_ARESETN] [get_bd_pins ps7_0_axi_periph/M38_ARESETN] \
  [get_bd_pins ps7_0_axi_periph/M39_ARESETN] [get_bd_pins ps7_0_axi_periph/M40_ARESETN] \
  [get_bd_pins ps7_0_axi_periph/M41_ARESETN] [get_bd_pins ps7_0_axi_periph/M42_ARESETN] \
  [get_bd_pins axi_gpio_2/s_axi_aresetn]
connect_bd_net [get_bd_pins rst_ps7_0_100M/interconnect_aresetn] [get_bd_pins ps7_0_axi_periph/ARESETN]
connect_bd_net [get_bd_pins processing_system7_0/FCLK_CLK1] [get_bd_ports FCLK_CLK1]
connect_bd_net [get_bd_pins processing_system7_0/FCLK_CLK2] [get_bd_ports FCLK_CLK2]

# ---- address map ----
assign_bd_address -offset 0x40000000 -range 8K -target_address_space [get_bd_addr_spaces processing_system7_0/Data] [get_bd_addr_segs axi_bram_ctrl_0/S_AXI/Mem0]
assign_bd_address -offset 0x41200000 -range 64K -target_address_space [get_bd_addr_spaces processing_system7_0/Data] [get_bd_addr_segs axi_gpio_0/S_AXI/Reg]
assign_bd_address -offset 0x41210000 -range 64K -target_address_space [get_bd_addr_spaces processing_system7_0/Data] [get_bd_addr_segs axi_gpio_1/S_AXI/Reg]
assign_bd_address -offset 0x41220000 -range 64K -target_address_space [get_bd_addr_spaces processing_system7_0/Data] [get_bd_addr_segs axi_gpio_2/S_AXI/Reg]
assign_bd_address -offset 0x41230000 -range 64K -target_address_space [get_bd_addr_spaces processing_system7_0/Data] [get_bd_addr_segs axi_gpio_3/S_AXI/Reg]
assign_bd_address -offset 0x41240000 -range 64K -target_address_space [get_bd_addr_spaces processing_system7_0/Data] [get_bd_addr_segs axi_gpio_4/S_AXI/Reg]
assign_bd_address -offset 0x41250000 -range 64K -target_address_space [get_bd_addr_spaces processing_system7_0/Data] [get_bd_addr_segs axi_gpio_5/S_AXI/Reg]
assign_bd_address -offset 0x41260000 -range 64K -target_address_space [get_bd_addr_spaces processing_system7_0/Data] [get_bd_addr_segs axi_gpio_6/S_AXI/Reg]
assign_bd_address -offset 0x41270000 -range 64K -target_address_space [get_bd_addr_spaces processing_system7_0/Data] [get_bd_addr_segs axi_gpio_7/S_AXI/Reg]
assign_bd_address -offset 0x41280000 -range 64K -target_address_space [get_bd_addr_spaces processing_system7_0/Data] [get_bd_addr_segs axi_gpio_8/S_AXI/Reg]
assign_bd_address -offset 0x41290000 -range 64K -target_address_space [get_bd_addr_spaces processing_system7_0/Data] [get_bd_addr_segs axi_gpio_9/S_AXI/Reg]
assign_bd_address -offset 0x412A0000 -range 64K -target_address_space [get_bd_addr_spaces processing_system7_0/Data] [get_bd_addr_segs axi_gpio_10/S_AXI/Reg]
assign_bd_address -offset 0x412B0000 -range 64K -target_address_space [get_bd_addr_spaces processing_system7_0/Data] [get_bd_addr_segs axi_gpio_11/S_AXI/Reg]
assign_bd_address -offset 0x412C0000 -range 64K -target_address_space [get_bd_addr_spaces processing_system7_0/Data] [get_bd_addr_segs axi_gpio_12/S_AXI/Reg]
assign_bd_address -offset 0x412D0000 -range 64K -target_address_space [get_bd_addr_spaces processing_system7_0/Data] [get_bd_addr_segs axi_gpio_13/S_AXI/Reg]
assign_bd_address -offset 0x412E0000 -range 64K -target_address_space [get_bd_addr_spaces processing_system7_0/Data] [get_bd_addr_segs axi_gpio_14/S_AXI/Reg]
assign_bd_address -offset 0x412F0000 -range 64K -target_address_space [get_bd_addr_spaces processing_system7_0/Data] [get_bd_addr_segs axi_gpio_15/S_AXI/Reg]
assign_bd_address -offset 0x41300000 -range 64K -target_address_space [get_bd_addr_spaces processing_system7_0/Data] [get_bd_addr_segs axi_gpio_16/S_AXI/Reg]
assign_bd_address -offset 0x41310000 -range 64K -target_address_space [get_bd_addr_spaces processing_system7_0/Data] [get_bd_addr_segs axi_gpio_17/S_AXI/Reg]
assign_bd_address -offset 0x41320000 -range 64K -target_address_space [get_bd_addr_spaces processing_system7_0/Data] [get_bd_addr_segs axi_gpio_18/S_AXI/Reg]
assign_bd_address -offset 0x41330000 -range 64K -target_address_space [get_bd_addr_spaces processing_system7_0/Data] [get_bd_addr_segs axi_gpio_19/S_AXI/Reg]
assign_bd_address -offset 0x41340000 -range 64K -target_address_space [get_bd_addr_spaces processing_system7_0/Data] [get_bd_addr_segs axi_gpio_20/S_AXI/Reg]
assign_bd_address -offset 0x41350000 -range 64K -target_address_space [get_bd_addr_spaces processing_system7_0/Data] [get_bd_addr_segs axi_gpio_21/S_AXI/Reg]
assign_bd_address -offset 0x41360000 -range 64K -target_address_space [get_bd_addr_spaces processing_system7_0/Data] [get_bd_addr_segs axi_gpio_22/S_AXI/Reg]
assign_bd_address -offset 0x41370000 -range 64K -target_address_space [get_bd_addr_spaces processing_system7_0/Data] [get_bd_addr_segs axi_gpio_23/S_AXI/Reg]
assign_bd_address -offset 0x41380000 -range 64K -target_address_space [get_bd_addr_spaces processing_system7_0/Data] [get_bd_addr_segs axi_gpio_24/S_AXI/Reg]
assign_bd_address -offset 0x41390000 -range 64K -target_address_space [get_bd_addr_spaces processing_system7_0/Data] [get_bd_addr_segs axi_gpio_25/S_AXI/Reg]
assign_bd_address -offset 0x413A0000 -range 64K -target_address_space [get_bd_addr_spaces processing_system7_0/Data] [get_bd_addr_segs axi_gpio_26/S_AXI/Reg]
assign_bd_address -offset 0x413B0000 -range 64K -target_address_space [get_bd_addr_spaces processing_system7_0/Data] [get_bd_addr_segs axi_gpio_27/S_AXI/Reg]
assign_bd_address -offset 0x413C0000 -range 64K -target_address_space [get_bd_addr_spaces processing_system7_0/Data] [get_bd_addr_segs axi_gpio_28/S_AXI/Reg]
assign_bd_address -offset 0x413D0000 -range 64K -target_address_space [get_bd_addr_spaces processing_system7_0/Data] [get_bd_addr_segs axi_gpio_29/S_AXI/Reg]
assign_bd_address -offset 0x413E0000 -range 64K -target_address_space [get_bd_addr_spaces processing_system7_0/Data] [get_bd_addr_segs axi_gpio_30/S_AXI/Reg]
assign_bd_address -offset 0x413F0000 -range 64K -target_address_space [get_bd_addr_spaces processing_system7_0/Data] [get_bd_addr_segs axi_gpio_31/S_AXI/Reg]
assign_bd_address -offset 0x41400000 -range 64K -target_address_space [get_bd_addr_spaces processing_system7_0/Data] [get_bd_addr_segs axi_gpio_32/S_AXI/Reg]
assign_bd_address -offset 0x41410000 -range 64K -target_address_space [get_bd_addr_spaces processing_system7_0/Data] [get_bd_addr_segs axi_gpio_33/S_AXI/Reg]
assign_bd_address -offset 0x41420000 -range 64K -target_address_space [get_bd_addr_spaces processing_system7_0/Data] [get_bd_addr_segs axi_gpio_34/S_AXI/Reg]
assign_bd_address -offset 0x41430000 -range 64K -target_address_space [get_bd_addr_spaces processing_system7_0/Data] [get_bd_addr_segs axi_gpio_35/S_AXI/Reg]
assign_bd_address -offset 0x41440000 -range 64K -target_address_space [get_bd_addr_spaces processing_system7_0/Data] [get_bd_addr_segs axi_gpio_36/S_AXI/Reg]
assign_bd_address -offset 0x42000000 -range 8K -target_address_space [get_bd_addr_spaces processing_system7_0/Data] [get_bd_addr_segs axi_bram_ctrl_1/S_AXI/Mem0]
assign_bd_address -offset 0x44000000 -range 8K -target_address_space [get_bd_addr_spaces processing_system7_0/Data] [get_bd_addr_segs axi_bram_ctrl_2/S_AXI/Mem0]
assign_bd_address -offset 0x46000000 -range 8K -target_address_space [get_bd_addr_spaces processing_system7_0/Data] [get_bd_addr_segs axi_bram_ctrl_3/S_AXI/Mem0]

validate_bd_design
save_bd_design
